# EasyEDA Pro project RadioFox.eprj, schematic Schematic1
Create Date: 2023-12-29; Page Name: P1; Project Name: RadioFox; Schematic Name: Schematic1; Update Date: 2023-12-28; Company: EasyEDA.com; Drawed: EasyEDA Pro; Page Size: A4; Part Number: JLCPCB-002; Reviewed: EasyEDA Pro; Version: V0.1
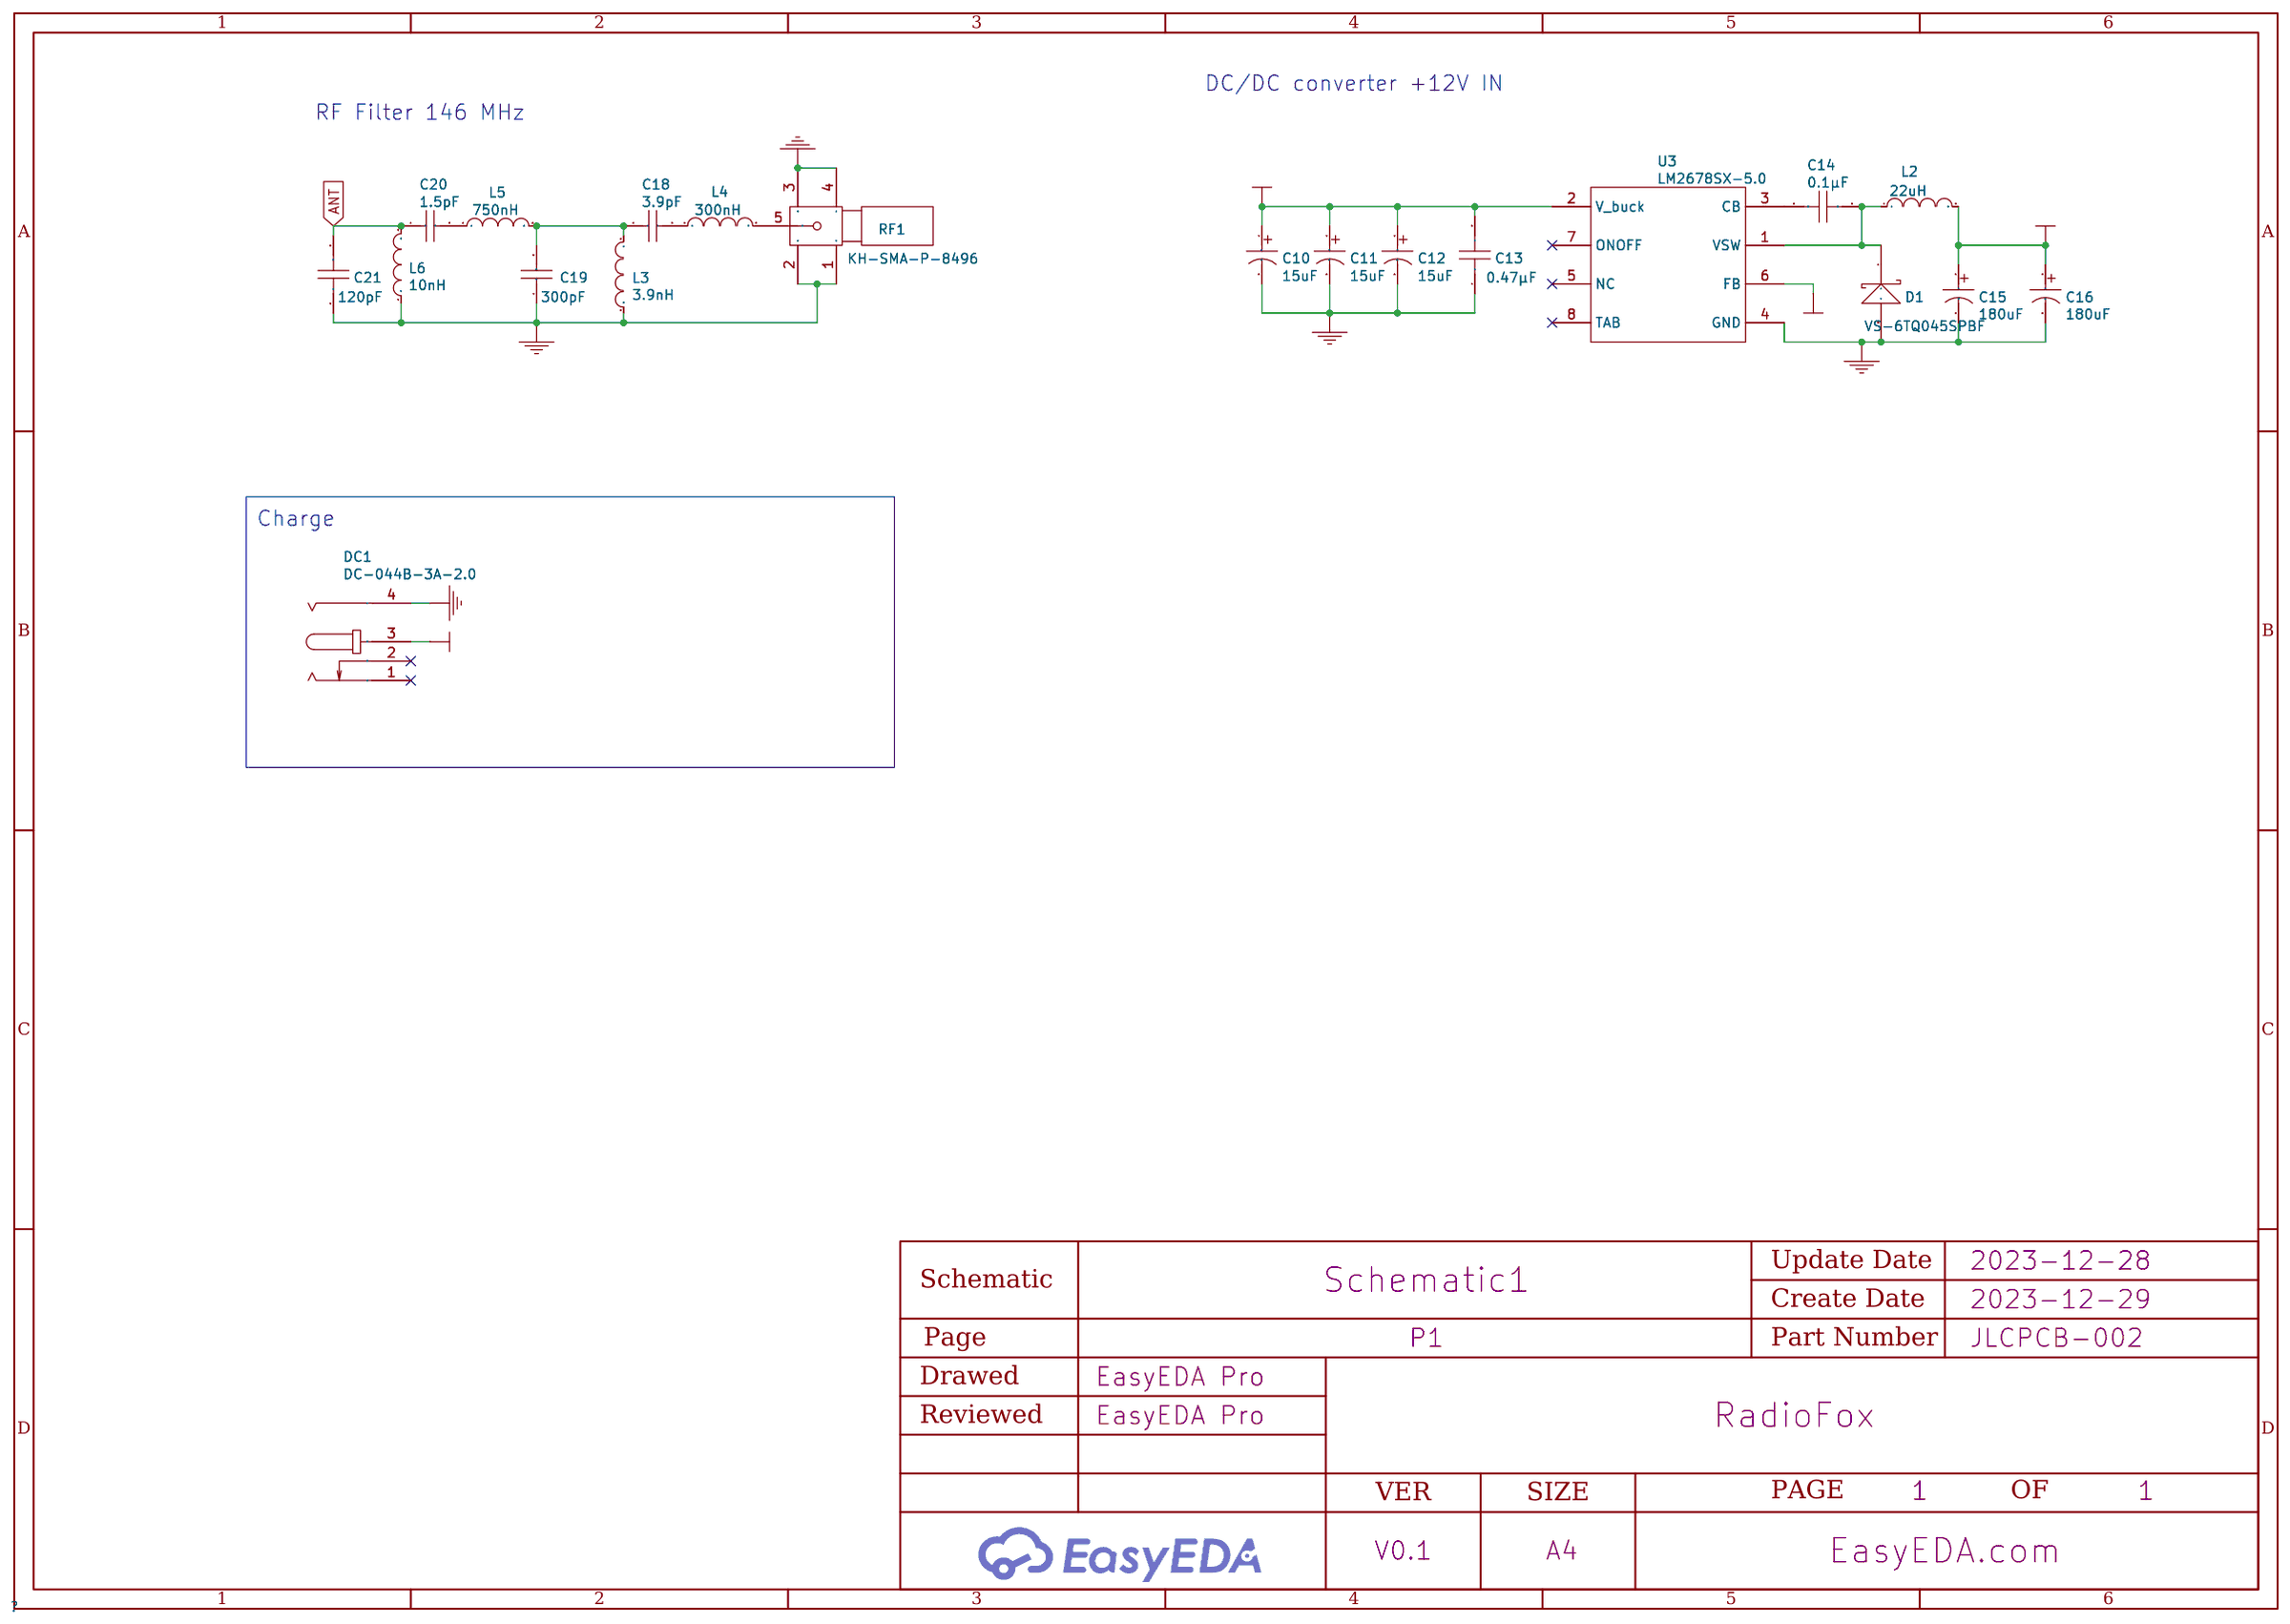
[diagram p1: schematic sheet]

## Parts
C10  15uF  [CAP-TH_BD5.0-P2.00-D0.8-FD]  (no BOM)
C11  15uF  [CAP-TH_BD5.0-P2.00-D0.8-FD]  (no BOM)
C12  15uF  [CAP-TH_BD5.0-P2.00-D0.8-FD]  (no BOM)
C13  0.47µF  (no BOM)
C14  0.1µF  (no BOM)
C15  180uF  [CAP-TH_BD8.0-P3.50-D0.6-FD]
C16  180uF  [CAP-TH_BD8.0-P3.50-D0.6-FD]
C18  3.9pF  [C1206]
C19  300pF  [C1206]
C20  1.5pF  [C1206]
C21  120pF  [C1206]
D1  VS-6TQ045SPBF  [TO-263-2_L10.0-W9.1-P5.08-LS15.2-BR]
DC1  DC-044B-3A-2.0  (no BOM)
L2  22uH  (no BOM)
L3  3.9nH  [IND-SMD_L3.5-W2.9]
L4  300nH  [IND-SMD_L3.0-W2.8_FEC1008CP]
L5  750nH  [IND-SMD_L3.0-W2.8_FEC1008CP]
L6  10nH  [IND-SMD_L3.0-W2.8_FEC1008CP]
RF1  KH-SMA-P-8496  [SMA-TH_KH-SMA-P-8496]
U3  LM2678SX-5.0  (no BOM)

## Library data of the parts
C10-C12 = GF150M050C110A: Capacitance: Tolerance:±20% Tolerance:±20% Rated Voltage: Lead Spacing: φD: L: Lifetime @ Temp:3000hrs@105℃; LCSC Part Name: 15uF ±20% 50V; Supplier Part: C77720; Manufacturer: CapXon(丰宾); Supplier Footprint: 插件,D5xL11mm; JLCPCB Part Class: Extended Part; Datasheet: https://atta.szlcsc.com/upload/public/pdf/source/20160702/1467448308038.pdf; Supplier: LCSC; Tolerance: ±20%; Lifetime @ Temp: 3000hrs@105℃
C13 C14 = ?: Supplier: LCSC
C15 C16 = ERZ1HM181F16OT: Capacitance: Tolerance:±20% Tolerance:±20% Rated Voltage: Ripple Current:- Equivalent Series Resistance(ESR):- Lead Spacing: φD: L: Lifetime @ Temp:8000hrs@105℃; LCSC Part Name: 180uF ±20% 50V; Supplier Part: C106716; Manufacturer: AISHI(艾华集团); Supplier Footprint: 插件,D8xL16mm; JLCPCB Part Class: Extended Part; Datasheet: https://atta.szlcsc.com/upload/public/pdf/source/20190702/C401568_75D1A74774D9723D712C99A7AE6B6902.pdf; Supplier: LCSC; Tolerance: ±20%; Lifetime @ Temp: 8000hrs@105℃
C18 = 1206CG3R9C500NT: Capacitance: Voltage Rated: Temperature Coefficient:; LCSC Part Name: 3.9pF 50V ±0.25pF; Supplier Part: C1913; Manufacturer: FH(风华); Supplier Footprint: 1206; JLCPCB Part Class: Extended Part; Datasheet: https://atta.szlcsc.com/upload/public/pdf/source/20200305/C486355_26A10D38EF8C2A5C37091D0039909270.pdf; Supplier: LCSC
C19 = 1206B301K500NT: Capacitance: Tolerance:±10% Tolerance:±10% Voltage Rated: Temperature Coefficient:; LCSC Part Name: 300pF ±10% 50V; Supplier Part: C1861; Manufacturer: FH(风华); Supplier Footprint: 1206; JLCPCB Part Class: Extended Part; Datasheet: https://atta.szlcsc.com/upload/public/pdf/source/20200305/C486355_26A10D38EF8C2A5C37091D0039909270.pdf; Supplier: LCSC; Tolerance: ±10%
C20 = 1206CG1R5C500NT: Capacitance: Voltage Rated: Temperature Coefficient:; LCSC Part Name: 1.5pF 50V ±0.25pF; Supplier Part: C1892; Manufacturer: FH(风华); Supplier Footprint: 1206; JLCPCB Part Class: Extended Part; Datasheet: https://atta.szlcsc.com/upload/public/pdf/source/20200305/C486355_26A10D38EF8C2A5C37091D0039909270.pdf; Supplier: LCSC
C21 = CC1206JRNPO9BN121: Capacitance: Tolerance:±5% Tolerance:±5% Voltage Rated: Temperature Coefficient:; LCSC Part Name: 120pF ±5% 50V; Supplier Part: C326851; Manufacturer: YAGEO(国巨); Supplier Footprint: 1206; JLCPCB Part Class: Extended Part; Datasheet: https://atta.szlcsc.com/upload/public/pdf/source/20181031/C326851_00C2AF43D32D7B0E11D479F2A8ECA727.pdf; Supplier: LCSC; Tolerance: ±5%
D1 = VS-6TQ045SPBF: Schottky Rectifier; Supplier Part: C145462; Manufacturer: VISHAY(威世); Supplier Footprint: TO-263-2; JLCPCB Part Class: Extended Part; Datasheet: https://atta.szlcsc.com/upload/public/pdf/source/20171211/C145462_15129763363951175275.pdf; Supplier: LCSC; Mounted: Yes
DC1 = DC-044B-3A-2.0: Supplier: LCSC; Supplier Part: C388627; Manufacturer: XKB Connectivity(中国星坤); JLCPCB Part Class: Extended Part
L2 = ?
L3 = FHW1210HC3N9KGT: Inductance: Tolerance:±10% Tolerance:±10% Rated Current: Saturation Current (Isat):- DC Resistance (DCR): Q @ Freq:30@300MHz Frequency - Self Resonant: Ratings:; LCSC Part Name: 3.9nH ±10% 50mΩ; Supplier Part: C318029; Manufacturer: FH(风华); Supplier Footprint: 1210; JLCPCB Part Class: Extended Part; Datasheet: https://atta.szlcsc.com/upload/public/pdf/source/20230223/DF03D309312E3B6C1D00E7403B334F90.pdf; Supplier: LCSC; Tolerance: ±10%; Q @ Freq: 30@300MHz
L4 = FEC1008CP-R30G-LRH: Inductance: Tolerance:±2% Tolerance:±2% Rated Current: Saturation Current (Isat):- DC Resistance (DCR): Q @ Freq:- Frequency - Self Resonant:- Ratings:; LCSC Part Name: 300nH ±2% 1.05Ω; Supplier Part: C346445; Manufacturer: PSA(信昌电陶); Supplier Footprint: 1008; JLCPCB Part Class: Extended Part; Datasheet: https://atta.szlcsc.com/upload/public/pdf/source/20190301/C346445_D6E08D0C0808C22C8419282A85CE60C0.pdf; Supplier: LCSC; Tolerance: ±2%
L5 = FEC1008CP-R75G-LRH: Inductance: Tolerance:±2% Tolerance:±2% Rated Current: Saturation Current (Isat):- DC Resistance (DCR): Q @ Freq:- Frequency - Self Resonant:- Ratings:; LCSC Part Name: 750nH ±2% 1.54Ω; Supplier Part: C346454; Manufacturer: PSA(信昌电陶); Supplier Footprint: 1008; JLCPCB Part Class: Extended Part; Datasheet: https://atta.szlcsc.com/upload/public/pdf/source/20190312/C346408_E6D8A2B979540C09788F871275EB71C7.pdf; Supplier: LCSC; Tolerance: ±2%
L6 = FEC1008CP-10NG-LRH: Inductance: Tolerance:±2% Tolerance:±2% Rated Current: Saturation Current (Isat):- DC Resistance (DCR): Q @ Freq:- Frequency - Self Resonant:- Ratings:; LCSC Part Name: 10nH ±2% 80mΩ; Supplier Part: C346404; Manufacturer: PSA(信昌电陶); Supplier Footprint: 1008; JLCPCB Part Class: Extended Part; Datasheet: https://atta.szlcsc.com/upload/public/pdf/source/20190312/C346408_E6D8A2B979540C09788F871275EB71C7.pdf; Supplier: LCSC; Tolerance: ±2%
RF1 = KH-SMA-P-8496: Connector Type:板端 Interface Type:内孔 Frequency-Max:- Interface Diameter:5.25mm RF Series:SMA Number of Ports:1 Impedance:- Style:弯头 Interface Length/Height:11mm Operating Temperature Range:- Operating Temperature Range:-; LCSC Part Name: SMA 内孔 弯头 镀金外螺内孔,11牙(三件套); Supplier Part: C910123; Manufacturer: kinghelm(金航标); Supplier Footprint: 插件; JLCPCB Part Class: Extended Part; Datasheet: https://atta.szlcsc.com/upload/public/pdf/source/20210317/C910123_D9C544C7B464C90B55B8BB4FC6044180.pdf; Supplier: LCSC; Connector Type: 板端; Interface Type: 内孔; Interface Diameter: 5.25mm; RF Series: SMA; Number of Ports: 1; Style: 弯头; Interface Length/Height: 11mm
U3 = ?: SIMPLE SWITCHER?High Efficiency 5A Step-Down Voltage Regulator, 7-pin TO-263

## Nets
GND: C10.2 C11.2 C12.2 C13.1 C15.2 C16.2 C19.1 C21.1 D1.3(A) DC1.4 L3.1 L6.1 RF1.1 RF1.2 RF1.3 RF1.4 U3.4(GND)
VIN5V: C15.1 C16.1 L2.2 U3.6(FB)
VIN12V: C10.1 C11.1 C12.1 C13.2 DC1.3 U3.2(V_buck)
ANT: C20.1 C21.2 L6.2
Net-(C14-1): C14.1 D1.1(K) L2.1 U3.1(VSW)
Net-(C14-2): C14.2 U3.3(CB)
Net-(C18-1): C18.1 C19.2 L3.2 L5.2
Net-(C18-2): C18.2 L4.1
Net-(C20-2): C20.2 L5.1
Net-(L4-2): L4.2 RF1.5

Not connected (* = marked no-connect by the designer): DC1 1* 2*; U3 5(NC)* 7(ONOFF)* 8(TAB)*

## Notes on the sheet
- DC/DC converter +12V IN
- RF Filter 146 MHz
- Charge
